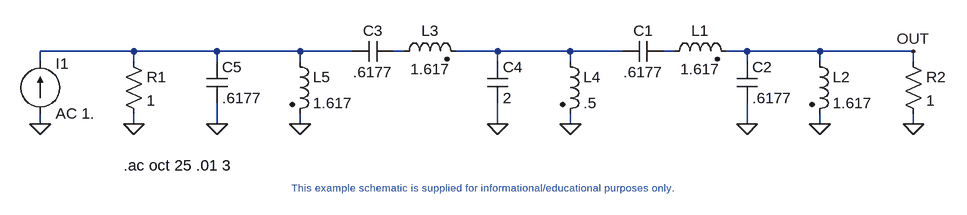
[diagram p0: schematic builtin_11_Butterworth.asc]
builtin_11_Butterworth.asc, the LTspice schematic file:
Version 4
SHEET 1 2536 1712
WIRE 1040 1120 896 1120
WIRE 1168 1120 1040 1120
WIRE 1296 1120 1168 1120
WIRE 1376 1120 1296 1120
WIRE 1456 1120 1440 1120
WIRE 1600 1120 1536 1120
WIRE 1712 1120 1600 1120
WIRE 1792 1120 1712 1120
WIRE 1872 1120 1856 1120
WIRE 1984 1120 1952 1120
WIRE 2096 1120 1984 1120
WIRE 2240 1120 2096 1120
WIRE 896 1136 896 1120
WIRE 1040 1136 1040 1120
WIRE 1168 1136 1168 1120
WIRE 1296 1136 1296 1120
WIRE 1600 1136 1600 1120
WIRE 1712 1136 1712 1120
WIRE 1984 1136 1984 1120
WIRE 2096 1136 2096 1120
WIRE 2240 1136 2240 1120
WIRE 896 1232 896 1216
WIRE 1040 1232 1040 1216
WIRE 1168 1232 1168 1200
WIRE 1296 1232 1296 1216
WIRE 1600 1232 1600 1200
WIRE 1712 1232 1712 1216
WIRE 1984 1232 1984 1200
WIRE 2096 1232 2096 1216
WIRE 2240 1232 2240 1216
FLAG 2240 1120 OUT
FLAG 896 1232 0
FLAG 1040 1232 0
FLAG 1168 1232 0
FLAG 1296 1232 0
FLAG 1600 1232 0
FLAG 1712 1232 0
FLAG 1984 1232 0
FLAG 2096 1232 0
FLAG 2240 1232 0
SYMBOL CURRENT 896 1216 M180
WINDOW 0 24 77 Left 2
WINDOW 3 24 0 Left 2
SYMATTR InstName I1
SYMATTR Value AC 1.
SYMBOL CAP 1856 1104 R90
WINDOW 0 0 32 VBottom 2
WINDOW 3 32 32 VTop 2
SYMATTR InstName C1
SYMATTR Value .6177
SYMBOL CAP 1968 1136 R0
SYMATTR InstName C2
SYMATTR Value .6177
SYMBOL CAP 1440 1104 R90
WINDOW 0 0 32 VBottom 2
WINDOW 3 32 32 VTop 2
SYMATTR InstName C3
SYMATTR Value .6177
SYMBOL CAP 1584 1136 R0
SYMATTR InstName C4
SYMATTR Value 2
SYMBOL CAP 1152 1136 R0
SYMATTR InstName C5
SYMATTR Value .6177
SYMBOL IND2 1856 1136 R270
WINDOW 0 32 56 VTop 2
WINDOW 3 4 56 VBottom 2
SYMATTR InstName L1
SYMATTR Value 1.617
SYMBOL IND2 2080 1120 R0
SYMATTR InstName L2
SYMATTR Value 1.617
SYMBOL IND2 1440 1136 R270
WINDOW 0 32 56 VTop 2
WINDOW 3 4 56 VBottom 2
SYMATTR InstName L3
SYMATTR Value 1.617
SYMBOL IND2 1696 1120 R0
SYMATTR InstName L4
SYMATTR Value .5
SYMBOL IND2 1280 1120 R0
SYMATTR InstName L5
SYMATTR Value 1.617
SYMBOL RES 1024 1120 R0
SYMATTR InstName R1
SYMATTR Value 1
SYMBOL RES 2224 1120 R0
SYMATTR InstName R2
SYMATTR Value 1
TEXT 1024 1296 Left 2 !.ac oct 25 .01 3
TEXT 1568 1320 Top 1 ;This example schematic is supplied for informational/educational purposes only.

The netlist it stands for:
* builtin_11_Butterworth.asc
I1 0 N001 AC 1.
C1 N004 N003 .6177
C2 OUT 0 .6177
C3 N002 N001 .6177
C4 N003 0 2
C5 N001 0 .6177
L1 N004 OUT 1.617
L2 OUT 0 1.617
L3 N002 N003 1.617
L4 N003 0 .5
L5 N001 0 1.617
R1 N001 0 1
R2 OUT 0 1
.ac oct 25 .01 3
* This example schematic is supplied for informational/educational purposes only.
.backanno
.end